# EAGLE design wheelSense_revB (EAGLE 8.0.0)
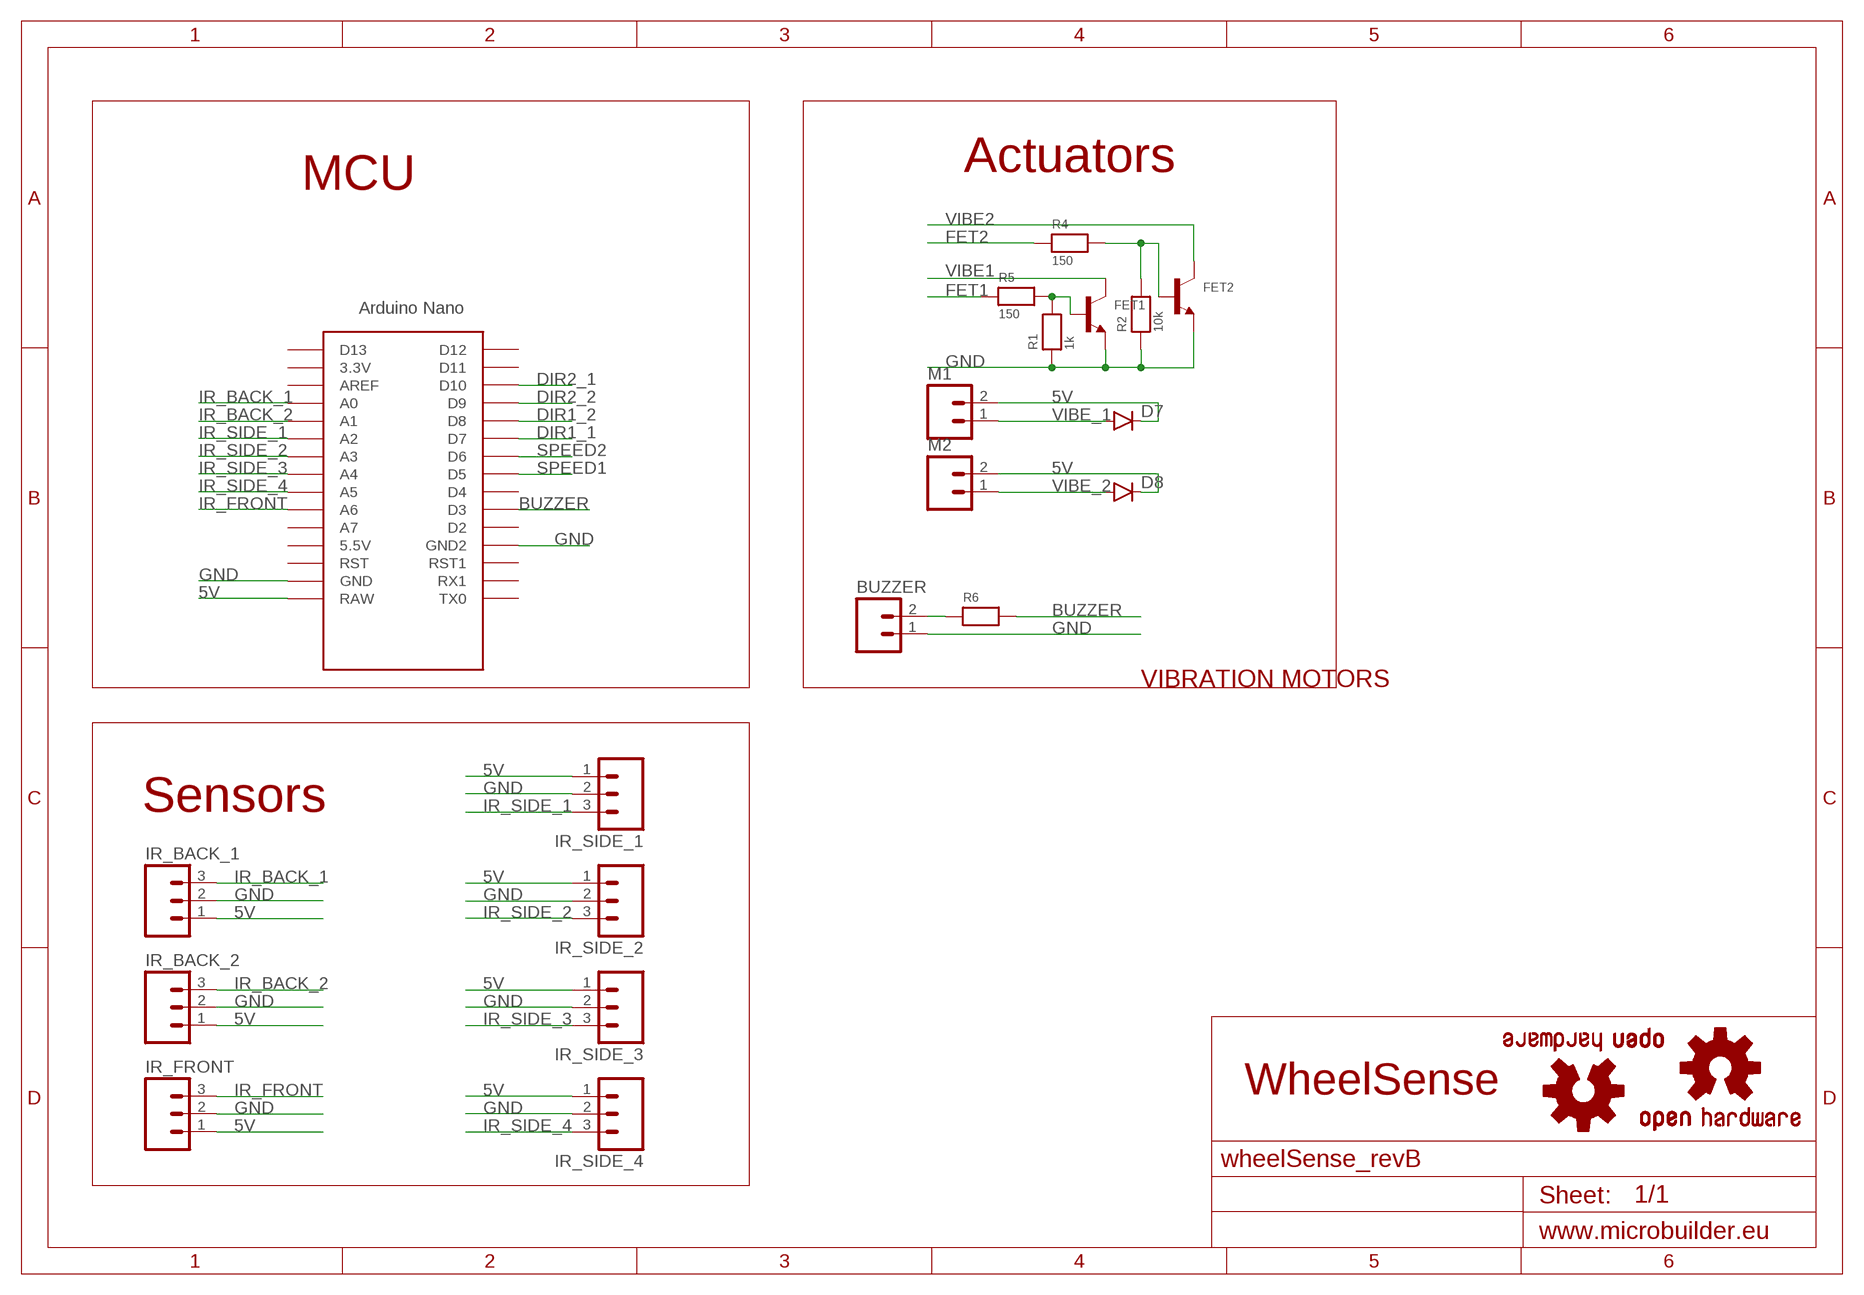
[diagram p0: schematic, sheet 1]

## Parts
BUZZER  M02POLAR  [MOLEX-1X2]
D7  DIODESOD123  [SOD-123]
D8  DIODESOD123  [SOD-123]
FET1  TRANSISTOR_NPN  [SOT23-R]
FET2  TRANSISTOR_NPN  [SOT23-R]
IR_BACK_1  M03POLAR  [MOLEX-1X3]
IR_BACK_2  M03POLAR  [MOLEX-1X3]
IR_FRONT  M03POLAR  [MOLEX-1X3]
IR_SIDE_1  M03POLAR  [MOLEX-1X3]
IR_SIDE_2  M03POLAR  [MOLEX-1X3]
IR_SIDE_3  M03POLAR  [MOLEX-1X3]
IR_SIDE_4  M03POLAR  [MOLEX-1X3]
LOGO1  OSHW-LOGOL-TOP  [OSHW_LOGO_L_TOP]
LOGO2  OSHW-LOGOL-TOP  [OSHW_LOGO_L_TOP]
M1  M02POLAR  [MOLEX-1X2]
M2  M02POLAR  [MOLEX-1X2]
R1  1k  RESISTOR0805  [0805]
R2  10k  RESISTOR0805  [0805]
R4  150  RESISTOR0805  [0805]
R5  150  RESISTOR0805  [0805]
R6  RESISTOR0805  [0805]
U$1  NANO  [NANO]

## Nets
5V: D7.C D8.C IR_BACK_1.1 IR_BACK_2.1 IR_FRONT.1 IR_SIDE_1.1 IR_SIDE_2.1 IR_SIDE_3.1 IR_SIDE_4.1 M1.2 M2.2 U$1.RAW
BUZZER: R6.2 U$1.D3
DIR1_1: U$1.D7
DIR1_2: U$1.D8
DIR2_1: U$1.D10
DIR2_2: U$1.D9
FET1: R5.1
FET2: R4.1
GND: BUZZER.1 FET1.2(E) FET2.2(E) IR_BACK_1.2 IR_BACK_2.2 IR_FRONT.2 IR_SIDE_1.2 IR_SIDE_2.2 IR_SIDE_3.2 IR_SIDE_4.2 R1.1 R2.1 U$1.GND U$1.GND1(GND2)
IR_BACK_1: IR_BACK_1.3 U$1.A0
IR_BACK_2: IR_BACK_2.3 U$1.A1
IR_FRONT: IR_FRONT.3 U$1.A6
IR_SIDE_1: IR_SIDE_1.3 U$1.A2
IR_SIDE_2: IR_SIDE_2.3 U$1.A3
IR_SIDE_3: IR_SIDE_3.3 U$1.A4
IR_SIDE_4: IR_SIDE_4.3 U$1.A5
N$1: BUZZER.2 R6.1
N$2: FET1.1(B) R1.2 R5.2
N$3: FET2.1(B) R2.2 R4.2
SPEED1: U$1.D5
SPEED2: U$1.D6
VIBE1: FET1.3(C)
VIBE2: FET2.3(C)
VIBE_1: D7.A M1.1
VIBE_2: D8.A M2.1
Unconnected: U$1.3.3V U$1.5V(5.5V) U$1.A7 U$1.AREF U$1.D2 U$1.D4 U$1.D11 U$1.D12 U$1.D13 U$1.ICSP1 U$1.ICSP2 U$1.ICSP3 U$1.ICSP4 U$1.ICSP5 U$1.ICSP6 U$1.RST U$1.RST1 U$1.RX1 U$1.TX0

## Notes on the sheet
- Actuators
- MCU
- VIBRATION MOTORS
- Sensors
- WheelSense

## Library data of the parts
BUZZER M1 M2 = SparkFun-Connectors:M02: Standard 2-pin 0.1" header. Use with - straight break away headers ( PRT-00116) - right angle break away headers (PRT-00553) - swiss pins (PRT-00743) - machine pins (PRT-00117) - female headers (PRT-00115) Molex polarized connector foot print use with: PRT-08233 with associated crimp pins and housings. 2.54_SCREWTERM for use with PRT-10571. 3.5mm Screw Terminal footprints for PRT-08084 5mm Screw Terminal footprints for use with PRT-08432
D7 D8 = SparkFun-DiscreteSemi:DIODE: Diode These are standard reverse protection diodes and small signal diodes. SMA package can handle up to about 1A. SOD-323 can handle about 200mA. What the SOD-323 package when ordering, there are some mfgs out there that are 5-pin packages.
FET1 FET2 = microbuilder:TRANSISTOR_NPN: NPN Transistor Transistor (NPN) 500mA 45V - BC817 [Digikey: 568-1631-1-ND] Transistor (NPN) 500mA 45V - BC817,215 [Mouser: 771-BC817-T/R] SOT23-R - SOT23 footprint optimised for use with solder paste and reflow ovens. SOT23-W - SOT23 footprint optimised for hand-soldering (larger pads).
IR_BACK_1 IR_BACK_2 IR_FRONT IR_SIDE_1-IR_SIDE_4 = SparkFun-Connectors:M03: Header 3 Standard 3-pin 0.1" header. Use with straight break away headers (SKU : PRT-00116), right angle break away headers (PRT-00553), swiss pins (PRT-00743), machine pins (PRT-00117), and female headers (PRT-00115). Molex polarized connector foot print use with SKU : PRT-08232 with associated crimp pins and housings.
LOGO1 LOGO2 = SparkFun-Aesthetics:OSHW-LOGO: Open Source Hardware Logo This logo indicates the piece of hardware it is found on incorporates a OSHW license and/or adheres to the definition of open source hardware found here: http://freedomdefined.org/OSHW
R1 R2 R4-R6 = microbuilder:RESISTOR: Resistors 0402 - 0402 Surface Mount Package 22 Ohm 1% 1/16W [Digikey: 311-22.0LRTR-ND] 33 Ohm 5% 1/16W 1.0K 5% 1/16W 1.5K 5% 1/16W 2.0K 1% 1/16W 10.0K 1% 1/16W [Digikey: 311-10.0KLRTR-ND] 10.0K 5% 1/16W [Digikey: RMCF0402JT10K0TR-ND] 12.1K 1% 1/16W [Digikey: 311-22.0LRTR-ND] 100.0K 5% 1/16W 0603 - 0603 Surface Mount Package 0 Ohm 1/10 Watt 1% Resistor 15 Ohm 1/10 Watt 1% Resistor 33 Ohm 1/10 Watt 1% Resistor 49.9 Ohm 1/10 Watt 1% Resistor 100 Ohm 1/10 Watt 1% Resistor 150 Ohm 1/10 Watt 1% Resistor 240 Ohm 1/10 Watt 1% Resistor 390 Ohm 1/10 Watt 1% Resistor 560 Ohm 1/10 Watt 1% Resistor 680 Ohm 1/10 Watt 1% Resistor 750 Ohm 1/10 Watt 1% Resistor 1.0K Ohm 1/10 Watt 1% Resistor 1.5K Ohm 1/10 Watt 1% Resistor 2.0K Ohm 1/10 Watt 1% Resistor 2.2K Ohm 1/10 Watt 1% Resistor 3.3K Ohm 1/10 Watt 1% Resistor 4.7K Ohm 1/10 Watt 1% Resistor 10.0K Ohm 1/10 Watt 1% Resistor 12.0K Ohm 1/10 Watt 1% Resistor 12.1K Ohm 1/10 Watt 1% Resistor 20.0K Ohm 1/10 Watt 1% Resistor 33.0K Ohm 1/10 Watt 1% Resistor 100.0K Ohm 1/10 Watt 1% Resistor 0805 - 0805 Surface Mount Package 0 Ohm 1/8 Watt 1% Resistor 33 Ohm 1/8 Watt 1% Resistor 100 Ohm 1/8 Watt 1% Resistor 150 Ohm 1/8 Watt 1% Resistor 200 Ohm 1/8 Watt 1% Resistor 240 Ohm 1/8 Watt 1% Resistor 330 Ohm 1/8 Watt 1% Resistor 390 Ohm 1/8 Watt 1% Resistor 470 Ohm 1/8 Watt 1% Resistor 1.0K Ohm 1/8 Watt 1% Resistor 1.5K Ohm 1/8 Watt 1% Resistor 2.0K Ohm 1/8 Watt 1% Resistor 4.7K Ohm 1/8 Watt 1% Resistor 5.1K Ohm 1/8 Watt 1% Resistor 5.6K Ohm 1/8 Watt 1% Resistor 10.0K Ohm 1/8 Watt 1% Resistor 22.0K Ohm 1/8 Watt 1% Resistor 33.0K Ohm 1/8 Watt 1% Resistor 100K Ohm 1/8 Watt 1% Resistor 1206 - 1206 Surface Mount Package 2012 - 2010 Surface Mount Package 0.11 Ohm 1/2 Watt 1% Resistor - Digikey: RHM.11UCT-ND
U$1 = Arduino-clone:NANO: Arduino Nano

## Board
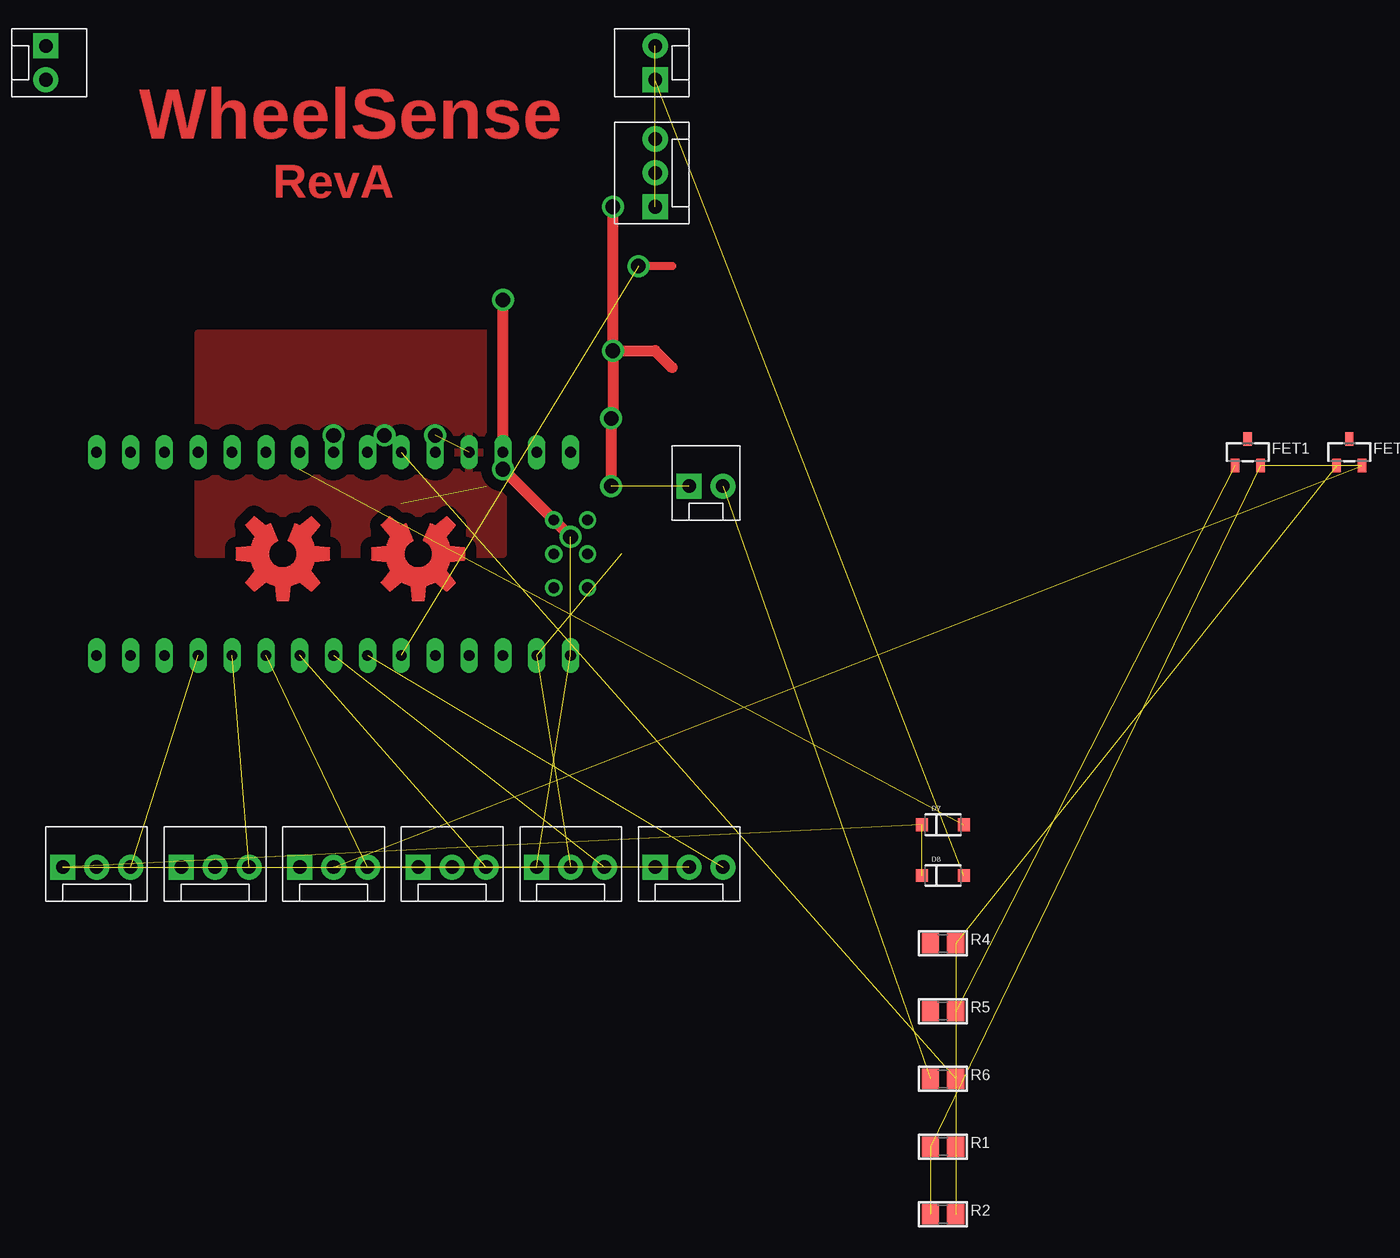
[diagram p1: board, top side]
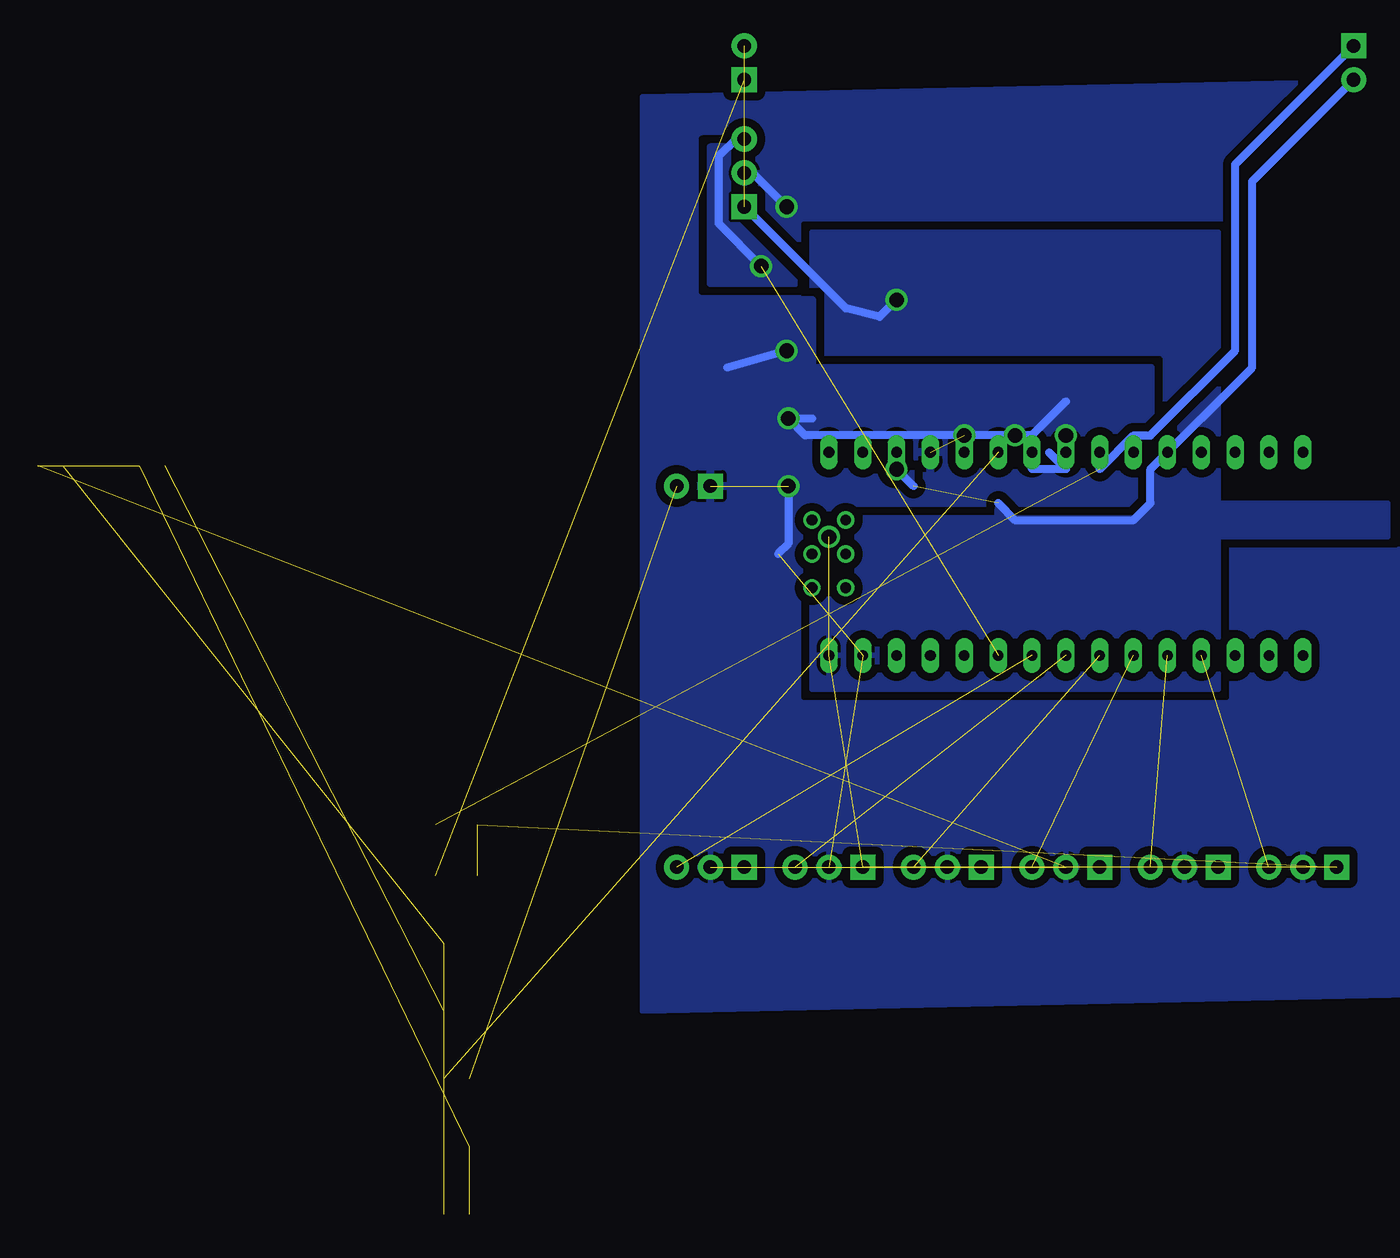
[diagram p2: board, bottom side, seen from below]

No outline drawn. Coordinates in mm, seen from the top.
Copper layers (1*16): Top 0.035mm / dielectric 1.5mm / Bottom 0.035mm
Design rules "default": minimum track width 10mil, minimum drill 24mil, track to track 8mil, track to pad 8mil, pad to pad 8mil, via to via 8mil, smd to smd 8mil, copper to edge 40mil, drill to drill 8mil, minimum pad ring 10mil, minimum via ring 8mil, stop-mask expansion 4mil, vias tented up to drill 0mil, thermal gap 10mil

### Footprints (pad centres in the part's own frame; a part is rotated, then mirrored left to right if it is on the bottom)
MOLEX-1X2 = drill 1.016 pad 1.88 square: 1 0,0 | drill 1.016 pad 1.88: 2 2.54,0
SOD-123 = smd 0.9 x 0.95: A 1.575,0; C -1.575,0
SOT23-R = smd 0.635 x 1.016: 1 -0.95,-1; 2 0.95,-1; 3 0,1
MOLEX-1X3 = drill 1.016 pad 1.88 square: 1 0,0 | drill 1.016 pad 1.88: 2 2.54,0; 3 5.08,0
0805 = smd 1.3 x 1.5: 1 -0.95,0; 2 0.95,0
NANO = drill 0.8 long: 3.3V -10.16,24.13; 5V -10.16,-1.27; A0 -10.16,19.05; A1 -10.16,16.51; A2 -10.16,13.97; A3 -10.16,11.43; A4 -10.16,8.89; A5 -10.16,6.35; A6 -10.16,3.81; A7 -10.16,1.27; AREF -10.16,21.59; D2 5.08,1.27; D3 5.08,3.81; D4 5.08,6.35; D5 5.08,8.89; D6 5.08,11.43; D7 5.08,13.97; D8 5.08,16.51; D9 5.08,19.05; D10 5.08,21.59; D11 5.08,24.13; D12 5.08,26.67; D13 -10.16,26.67; GND -10.16,-6.35; GND1 5.08,-1.27; RAW -10.16,-8.89; RST -10.16,-3.81; RST1 5.08,-3.81; RX1 5.08,-6.35; TX0 5.08,-8.89 | drill 0.8: ICSP1 -5.08,-10.16; ICSP2 -5.08,-7.62; ICSP3 -2.54,-10.16; ICSP4 -2.54,-7.62; ICSP5 0,-10.16; ICSP6 0,-7.62

### Placement (x,y rotation side)
BUZZER  54.61,33.02 0 top
D7  73.66,7.62 0 top
D8  73.66,3.81 0 top
FET1  96.52,35.56 0 top
FET2  104.14,35.56 0 top
IR_BACK_1  7.62,4.45 0 top
IR_BACK_2  16.51,4.45 0 top
IR_FRONT  52.07,53.98 90 top
IR_SIDE_1  25.4,4.45 0 top
IR_SIDE_2  34.29,4.45 0 top
IR_SIDE_3  43.18,4.45 0 top
IR_SIDE_4  52.07,4.45 0 top
LOGO1  34.29,27.94 180 top
LOGO2  24.13,27.94 180 top
M1  6.35,66.04 270 top
M2  52.07,63.5 90 top
R1  73.66,-16.51 0 top
R2  73.66,-21.59 0 top
R4  73.66,-1.27 0 top
R5  73.66,-6.35 0 top
R6  73.66,-11.43 0 top
U$1  36.83,30.48 90 top

### Tracks (layer width: path | path; a pad name or v marks a point on that pad's centre or on a via)
5V  (via drill 1.1)  (11 unrouted)
  Top 0.813: v45.72,29.21 v40.64,34.29 v40.64,46.99
  Bottom 0.61: 39.37,33.02 v40.64,34.29 | v40.64,46.99 41.91,45.72 44.45,46.35 IR_FRONT.1 | 33.02,31.75 31.75,30.48 22.86,30.48 21.59,31.75 21.59,34.29 13.97,41.91 13.97,55.88 M1.2
  pour Bottom (isolate 0.61, rank 2): 3.81,29.21 16.51,29.21 16.51,17.78 46.99,17.78 46.99,52.07 16.51,52.07 16.51,31.75 3.81,31.75
BUZZER  (1 unrouted)
GND  (via drill 1.1)  (13 unrouted)
  Top 0.61: 48.9,38.1 v48.77,38.1
  Top 0.813: v48.9,43.18 52.07,43.18 53.34,41.91 | v48.9,43.18 v48.9,53.98 | v48.9,43.18 48.9,38.1 | v48.77,38.1 v48.77,33.02
  Bottom 0.61: v27.94,36.83 27.94,34.29 | 27.94,39.37 30.48,36.83 | IR_FRONT.2 51.44,56.52 v48.9,53.98 | 27.94,34.29 29.21,35.56 | v48.9,43.18 53.34,41.91 | 46.99,38.1 v48.77,38.1 47.5,36.83 v35.56,36.83 v31.75,36.83 30.48,36.83 | 27.94,34.29 30.48,34.29 30.48,36.83 | v48.77,33.02 48.77,28.7 49.53,27.94
  pour Bottom (isolate 0.61, rank 3): 0,63.5 59.69,62.23 59.69,-6.35 0,-5.08
  pour Bottom (isolate 0.61): 21.59,41.91 21.59,31.75 57.15,31.75 57.15,46.99 46.99,46.99 46.99,41.91
  pour Top (isolate 0.813): 17.78,44.45 17.78,27.94 40.64,27.94 40.64,44.45
IR_BACK_1  (1 unrouted)
IR_BACK_2  (1 unrouted)
IR_FRONT  (via drill 1.1)  (1 unrouted)
  Top 0.61: 53.34,49.53 v50.8,49.53
  Bottom 0.61: IR_FRONT.3 52.7,59.05 53.98,57.78 53.98,52.7 v50.8,49.53
  pour Bottom: 54.61,48.26 48.26,48.26 53.34,53.34 53.34,58.42 54.61,58.42
IR_SIDE_1  (1 unrouted)
IR_SIDE_2  (1 unrouted)
IR_SIDE_3  (1 unrouted)
IR_SIDE_4  (1 unrouted)
N$1  (1 unrouted)
N$2  (2 unrouted)
N$3  (2 unrouted)
VIBE_1  (1 unrouted)
  Bottom 0.61: 25.4,34.29 22.86,36.83 21.59,36.83 15.24,43.18 15.24,57.15 M1.1
VIBE_2  (1 unrouted)

### Text on the board
Top: WheelSense | RevA